# Altium schematic sheet Out_Inputs.SchDoc
size A4; SheetNumber: 2; SheetTotal: 2
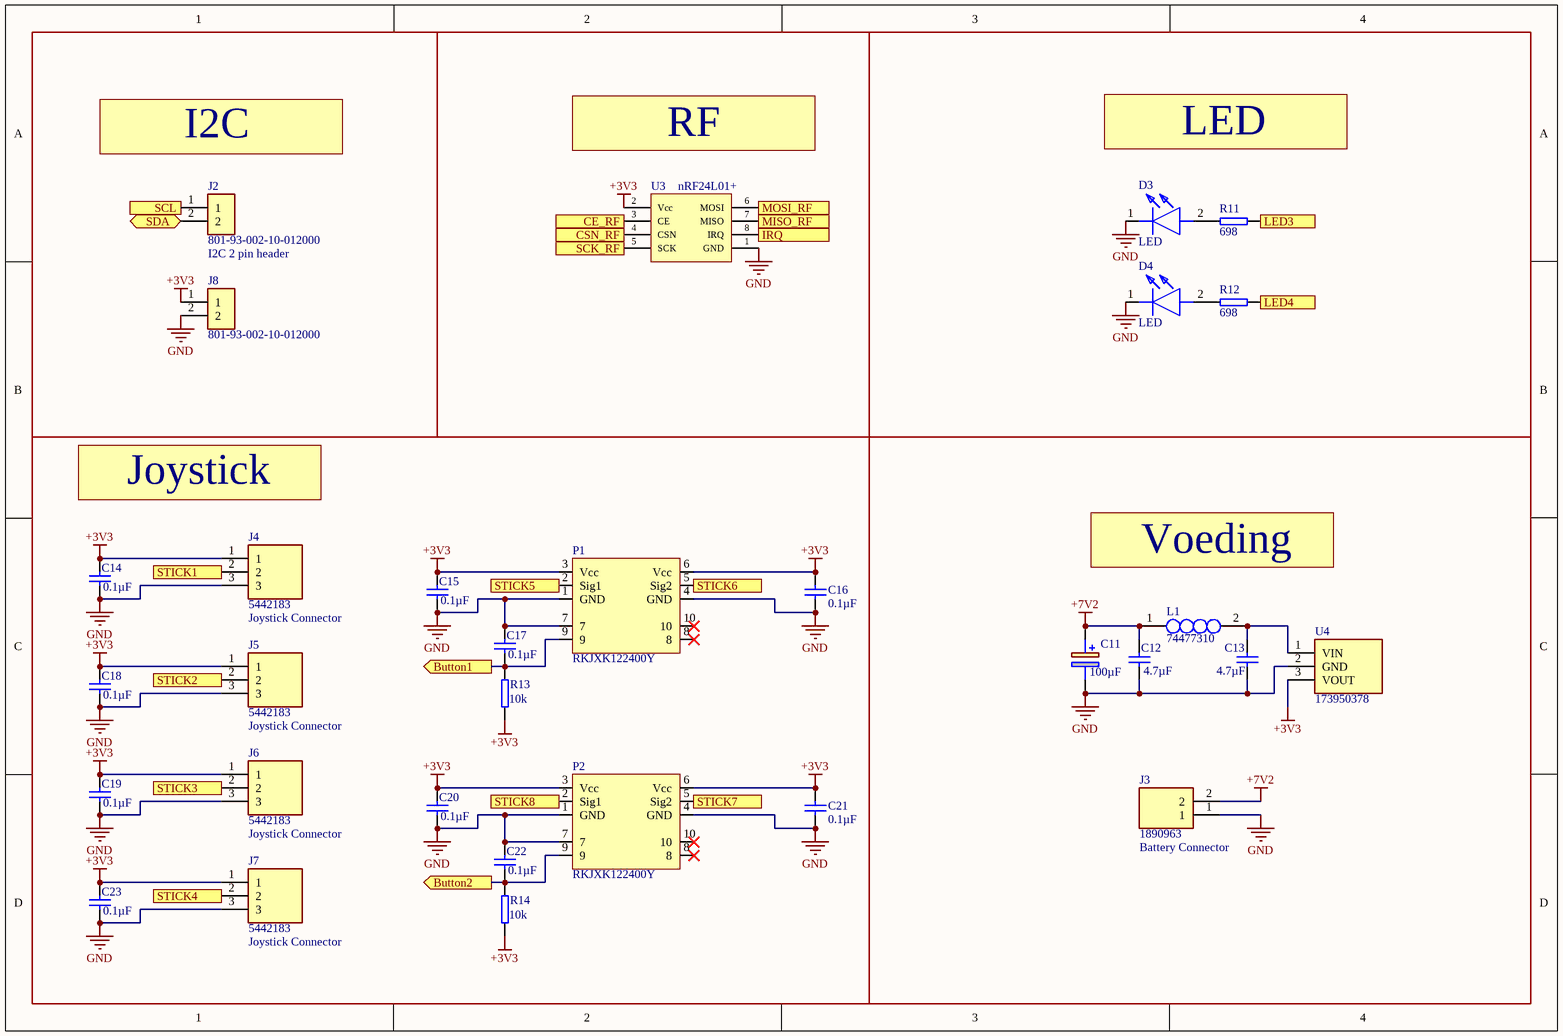
[diagram p0: Out_Inputs.SchDoc]

## Parts
C11  100µF  [CAPPRD350W52D800H1300]
C12  4.7µF  [Capacitor 1206]
C13  4.7µF  [Capacitor 1206]
C14  0.1µF  [Capacitor 0603]
C15  0.1µF  [Capacitor 0603]
C16  0.1µF  [Capacitor 0603]
C17  0.1µF  [Capacitor 0603]
C18  0.1µF  [Capacitor 0603]
C19  0.1µF  [Capacitor 0603]
C20  0.1µF  [Capacitor 0603]
C21  0.1µF  [Capacitor 0603]
C22  0.1µF  [Capacitor 0603]
C23  0.1µF  [Capacitor 0603]
D3  LED  [HLMP-4740]
D4  LED  [HLMP-4740]
J2  801-93-002-10-012000  [801-93-002-10-012000]
J3  1890963  [1890963]
J4  5442183  [5442183]
J5  5442183  [5442183]
J6  5442183  [5442183]
J7  5442183  [5442183]
J8  801-93-002-10-012000  [801-93-002-10-012000]
L1  74477310  [WE-PD2_453255]
P1  RKJXK122400Y  [RKJXK122400Y]
P2  RKJXK122400Y  [RKJXK122400Y]
R11  698  [Resistor 0603]
R12  698  [Resistor 0603]
R13  10k  [Resistor 0603]
R14  10k  [Resistor 0603]
U3  nRF24L01+  [nRF24L01+]
U4  173950378  [173950378]

## Blocks framed on the sheet
Joystick: C14-C23 J4-J7 P1 P2 R13 R14

## Ports
Button1 (out, see Main_Board_Controller[3A]), Button2 (out, see Main_Board_Controller[3B]), CE_RF (in, see Main_Board_Controller[4A]), CSN_RF (in, see Main_Board_Controller[4A]), IRQ (out, see Main_Board_Controller[4A]), LED3 (in, see Main_Board_Controller[4B]), LED4 (in, see Main_Board_Controller[4B]), MISO_RF (out, see Main_Board_Controller[4A]), MOSI_RF (in, see Main_Board_Controller[4B]), SCK_RF (in, see Main_Board_Controller[4A]), SCL (in, see Main_Board_Controller[4A]), SDA (bidir, see Main_Board_Controller[4A]), STICK1 (out, see Main_Board_Controller[3A]), STICK2 (out, see Main_Board_Controller[3A]), STICK3 (out, see Main_Board_Controller[3A]), STICK4 (out, see Main_Board_Controller[3A]), STICK5 (out, see Main_Board_Controller[3A]), STICK6 (out, see Main_Board_Controller[3A]), STICK7 (out, see Main_Board_Controller[3B]), STICK8 (out, see Main_Board_Controller[3B])

## Nets
+3V3: C14.1 C15.1 C16.1 C18.1 C19.1 C20.1 C21.1 C23.1 J4.1 J5.1 J6.1 J7.1 J8.1 P1.3(Vcc) P1.6(Vcc) P2.3(Vcc) P2.6(Vcc) R13.2 R14.2 U3.2(Vcc) U4.3(VOUT)
+7V2: C11.1(+) C12.1 J3.2 L1.1
GND: C11.2(-) C12.2 C13.2 C14.2 C15.2 C16.2 C17.1 C18.2 C19.2 C20.2 C21.2 C22.1 C23.2 D3.1(K) D4.1(K) J3.1 J4.3 J5.3 J6.3 J7.3 J8.2 P1.1(GND) P1.4(GND) P1.7 P2.1(GND) P2.4(GND) P2.7 U3.1(GND) U4.2(GND)
Button1: C17.2 P1.9 R13.1 ; port Button1
Button2: C22.2 P2.9 R14.1 ; port Button2
CE_RF: U3.3(CE) ; port CE_RF
CSN_RF: U3.4(CSN) ; port CSN_RF
IRQ: U3.8(IRQ) ; port IRQ
LED3: R11.1 ; port LED3
LED4: R12.1 ; port LED4
MISO_RF: U3.7(MISO) ; port MISO_RF
MOSI_RF: U3.6(MOSI) ; port MOSI_RF
SCK_RF: U3.5(SCK) ; port SCK_RF
SCL: J2.1 ; port SCL
SDA: J2.2 ; port SDA
STICK1: J4.2 ; port STICK1
STICK2: J5.2 ; port STICK2
STICK3: J6.2 ; port STICK3
STICK4: J7.2 ; port STICK4
STICK5: P1.2(Sig1) ; port STICK5
STICK6: P1.5(Sig2) ; port STICK6
STICK7: P2.5(Sig2) ; port STICK7
STICK8: P2.2(Sig1) ; port STICK8
NetC13_1: C13.1 L1.2 U4.1(VIN)
NetD3_2: D3.2(A) R11.2
NetD4_2: D4.2(A) R12.2

Not connected (* = marked no-connect by the designer): P1 8* 10*; P2 8* 10*

## Notes on the sheet
- I2C
- RF
- LED
- I2C 2 pin header
- Voeding
- Joystick Connector
- (near J3) Battery Connector
- (near J7) Joystick Connector

## Library data of the parts
C11 = 860010674014: Wurth Elektronik 100uF 50 V dc Aluminium Electrolytic Capacitor; Manufacturer_Part_Number: 865080543009; Geometry.Height: 5.5mm; Mouser Part Number: 710-865080543009; Mouser Price/Stock: https://www.mouser.co.uk/ProductDetail/Wurth-Elektronik/865080543009?qs=0KOYDY2FL2%2F%252BYmhMLtEhDQ%3D%3D; Manufacturer_Name: Wurth Elektronik; Datasheet Link: https://katalog.we-online.de/pbs/datasheet/865080543009.pdf; Mouser: 710-860010674014
C12 C13 = Capacitor 1206: Capacitor; Mouser: 710-885012208094
C14-C23 = Capacitor 0603: Capacitor
J2 J8 = 801-93-002-10-012000: 2 pin header 2.54mm pitch; Mouser: 575-8019300210012000
J3 = 1890963: Connector: 2pin screw terminal; Manufacturer_Name: Phoenix Contact; Datasheet Link: http://www.phoenixcontact.com/de/produkte/1890963/pdf; Height: 15.15mm; Manufacturer_Part_Number: 1890963; Mouser Part Number: 651-1890963; Mouser Price/Stock: https://www.mouser.co.uk/ProductDetail/Phoenix-Contact/1890963?qs=5W%252BNKB25SvKX6KIA0xFJOA%3D%3D; Arrow Part Number: 1890963; Arrow Price/Stock: https://www.arrow.com/en/products/1890963/phoenix-contact?region=nac
J4-J7 = 5442183: Connector; Manufacturer_Name: Phoenix Contact; Datasheet Link: http://www.phoenixcontact.net/product/5442183; Height: 10.12mm; Manufacturer_Part_Number: 5442183; Mouser Part Number: 651-5442183; Mouser Price/Stock: https://www.mouser.co.uk/ProductDetail/Phoenix-Contact/5442183?qs=9Y9qB%2FCsC3nrqTUHTUeJoQ%3D%3D; Arrow Part Number: 5442183; Arrow Price/Stock: https://www.arrow.com/en/products/5442183/phoenix-contact?region=nac
L1 = 7447730: Inductor; Manufacturer_Name: Wurth Elektronik; Manufacturer_Part_Number: 7447730; Mouser Part Number: 710-7447730; Mouser Price/Stock: https://www.mouser.co.uk/ProductDetail/Wurth-Elektronik/7447730?qs=rS3zZhy2AQMpnsrOMerOTw%3D%3D; Mouser: 710-74477310
R11-R14 = Resistor 0603: Resistor
U4 = 173950378: MagI3C Power Module 0.5A 3.3V 6-28V SIP3; Manufacturer_Name: Wurth Elektronik; Geometry.Height: 11mm; Mouser Part Number: 710-173950378; Mouser Price/Stock: https://www.mouser.co.uk/ProductDetail/Wurth-Elektronik/173950378?qs=SElPoaY2y5Iv2HEnICmd%252BA%3D%3D; Manufacturer_Part_Number: 173950378; Datasheet Link: http://katalog.we-online.de/pm/datasheet/173950378.pdf